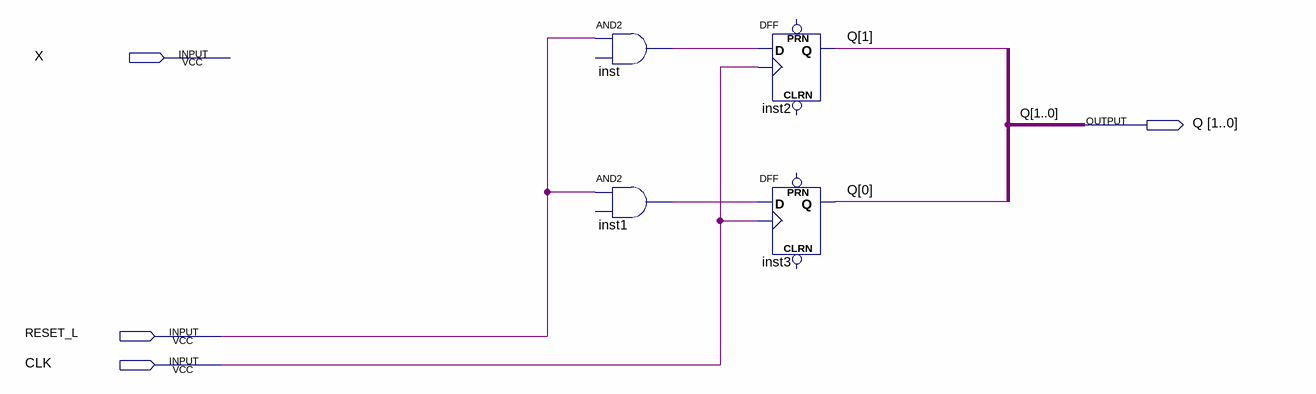
[diagram p0: schematic sheet]
// Quartus schematic MEF.bdf as structural Verilog: 4 symbols, 4 pins
module MEF (
  input  X,
  input  RESET_L,
  input  CLK,
  output [1:0] Q
);

  wire inst1_out, inst_out;

  buf inst (inst_out, RESET_L);  // AND2 open: IN2
  buf inst1 (inst1_out, RESET_L);  // AND2 open: IN2
  DFF inst2 (.CLK(CLK), .D(inst_out), .Q(Q[1]));  // open: CLRN, PRN
  DFF inst3 (.CLK(CLK), .D(inst1_out), .Q(Q[0]));  // open: CLRN, PRN
endmodule
